# EAGLE design muscle (EAGLE 9.4.2)
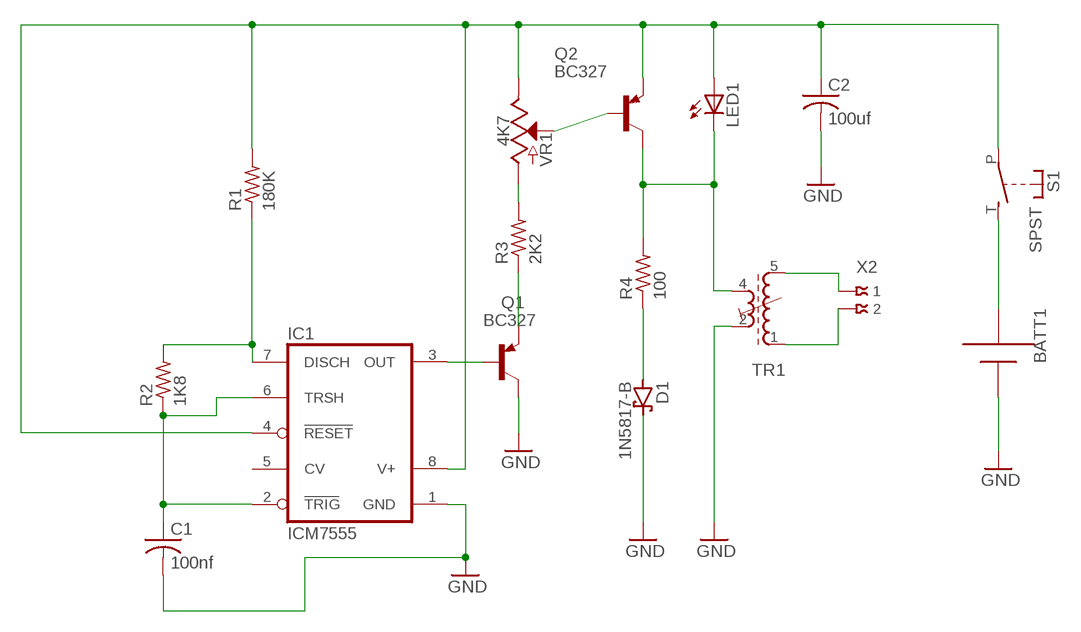
[diagram p0: schematic, sheet 1]

## Parts
BATT1  AAA  [12BH412]
C1  100nf  C-US025-024X044  [C025-024X044]
C2  100uf  C-US025-024X044  [C025-024X044]
D1  1N5817-B  [DO41-7.6]
IC1  ICM7555  [DIL08]
LED1  LED3MM  [LED3MM]
Q1  BC327  [TO92]
Q2  BC327  [TO92]
R1  180K  R-US_0204/2V  [0204V]
R2  1K8  R-US_0204/2V  [0204V]
R3  2K2  R-US_0204/2V  [0204V]
R4  100  R-US_0204/2V  [0204V]
S1  SPST  [JUDCOSPST]
TR1  71-4-1524  [71-5]
VR1  4K7  POTENTIOMETER_SLIDE-20MM-1/10W-20%  [SLIDER-SMALL]
X2  009177002  [009177002]

## Nets
GND: BATT1.+ C1.2 C2.2 D1.C IC1.1(GND) Q1.3(C) TR1.2(A2)
N$1: IC1.3(OUT) Q1.2(B)
N$2: Q1.1(E) R3.1
N$3: R3.2 VR1.BOTTOM(A)
N$4: Q2.2(B) VR1.WIPER(S)
N$5: IC1.7(DISCH) R1.1 R2.2
N$6: C1.1 IC1.2(TRIG) IC1.6(TRSH) R2.1
N$7: C2.1 IC1.4(RESET) IC1.8(V+) LED1.A Q2.1(E) R1.2 S1.P VR1.TOP(E)
N$8: D1.A R4.1
N$9: BATT1.- S1.T(S)
N$10: LED1.K(C) Q2.3(C) R4.2 TR1.4(E2)
N$11: TR1.5(E1) X2.1
N$12: TR1.1(A1) X2.2
Unconnected: IC1.5(CV) TR1.S1 TR1.S2

## Library data of the parts
BATT1 = adafruit:AAA: AAA PC pin holder Mouser part #12BH412 - but pretty much any 1x AAA battery holder should be the same http://www.ladyada.net/library/pcb/eaglelibrary.html; MF: BULGIN; MPN: BX0034; OC_FARNELL: 301061
C1 = adafruit:C-US: CAPACITOR, American symbol; MF: AVX; MPN: 12065C104KAT2A; OC_FARNELL: 499389
C2 = adafruit:C-US: CAPACITOR, American symbol; MF: KEMET; MPN: C1210C107M9PACTU; OC_FARNELL: 1108328
D1 = diode:1N581*: 1.0A SCHOTTKY BARRIER RECTIFIER Source: http://www.diodes.com/datasheets/ds23001.pdf; MF: ON SEMICONDUCTOR; MPN: 1N5817G; OC_FARNELL: 1458990
IC1 = maxim:ICM7555: TIMER; MF: RENESAS; MPN: ICM7555IPAZ; OC_FARNELL: 9663762; OC_NEWARK: 68K4387
LED1 = adafruit:LED: LED OSRAM: - CHIPLED LG R971, LG N971, LY N971, LG Q971, LY Q971, LO R971, LY R971 LH N974, LH R974 LS Q976, LO Q976, LY Q976 LO Q996 - Hyper CHIPLED LW Q18S LB Q993, LB Q99A, LB R99A - SideLED LS A670, LO A670, LY A670, LG A670, LP A670 LB A673, LV A673, LT A673, LW A673 LH A674 LY A675 LS A676, LA A676, LO A676, LY A676, LW A676 LS A679, LY A679, LG A679 - Hyper Micro SIDELED® LS Y876, LA Y876, LO Y876, LY Y876 LT Y87S - SmartLED LW L88C, LW L88S LB L89C, LB L89S, LG L890 LS L89K, LO L89K, LY L89K LS L896, LA L896, LO L896, LY L896 - TOPLED LS T670, LO T670, LY T670, LG T670, LP T670 LSG T670, LSP T670, LSY T670, LOP T670, LYG T670 LG T671, LOG T671, LSG T671 LB T673, LV T673, LT T673, LW T673 LH T674 LS T676, LA T676, LO T676, LY T676, LB T676, LH T676, LSB T676, LW T676 LB T67C, LV T67C, LT T67C, LS T67K, LO T67K, LY T67K, LW E67C LS E67B, LA E67B, LO E67B, LY E67B, LB E67C, LV E67C, LT E67C LW T67C LS T679, LY T679, LG T679 LS T770, LO T770, LY T770, LG T770, LP T770 LB T773, LV T773, LT T773, LW T773 LH T774 LS E675, LA E675, LY E675, LS T675 LS T776, LA T776, LO T776, LY T776, LB T776 LHGB T686 LT T68C, LB T68C - Hyper Mini TOPLED® LB M676 - Mini TOPLED Santana® LG M470 LS M47K, LO M47K, LY M47K Source: http://www.osram.convergy.de/; MF: KINGBRIGHT; MPN: L-424IDT; OC_FARNELL: 1142497
Q1 Q2 = transistor-pnp:BC327: PNP Transistor; OC_FARNELL: unknown
R1-R4 = adafruit:R-US_: RESISTOR, American symbol; OC_FARNELL: unknown
S1 = adafruit:SPST: Judco 50-0015-00; OC_FARNELL: unknown
TR1 = inductor-neosid:71-4-: TRANSFORMER adjustable filter transformer; OC_FARNELL: unknown; OC_NEWARK: unknown
VR1 = SparkFun-Resistors:POTENTIOMETER_SLIDE: Slide Potentiometer Slide-type potentiometers - pots that are adjusted by sliding a wiper up or down. Commonly found en-masse on sound boards. Variants 60MM - Slide Pot - X-Large (10k Linear Taper) <https://www.sparkfun.com/products/9119> (COM-09119) 10k linear slide pot with 60mm travel. Datasheet <http://cdn.sparkfun.com/datasheets/Components/Switches/SC608N-b10k.pdf> 30MM, 30MM-KIT - Slide Pot - Medium (10k Linear Taper) <https://www.sparkfun.com/products/11621> (COM-11621) 10k linear slide pot with 30mm travel. Datasheet <http://cdn.sparkfun.com/datasheets/Components/Switches/C-31-.pdf> (C3031N-1A2-B10K-GP) "KIT" variant, intended for soldering kits, has tStop removed from pads so the component can only be stuffed on one side of the board. 20MM - Slide Pot - Small (10k Linear Taper) <https://www.sparkfun.com/products/11620> (COM-11620) 10k linear slide pot with 20mm travel. Datasheet <http://cdn.sparkfun.com/datasheets/Components/Switches/C-31-.pdf> (C2031N-1A2-B10K-GP); OC_FARNELL: unknown; PROD_ID: RES-11924; SF_SKU: COM-11620; VALUE: 10k
X2 = con-avx:00917?002: Wire to Board Strip IDC Connector 2 WAY Source: http://www.avx.com/docs/Catalogs/9176.pdf http://www.avx.com/docs/Catalogs/9177.pdf; OC_FARNELL: unknown; OC_NEWARK: 09P1124

## Board
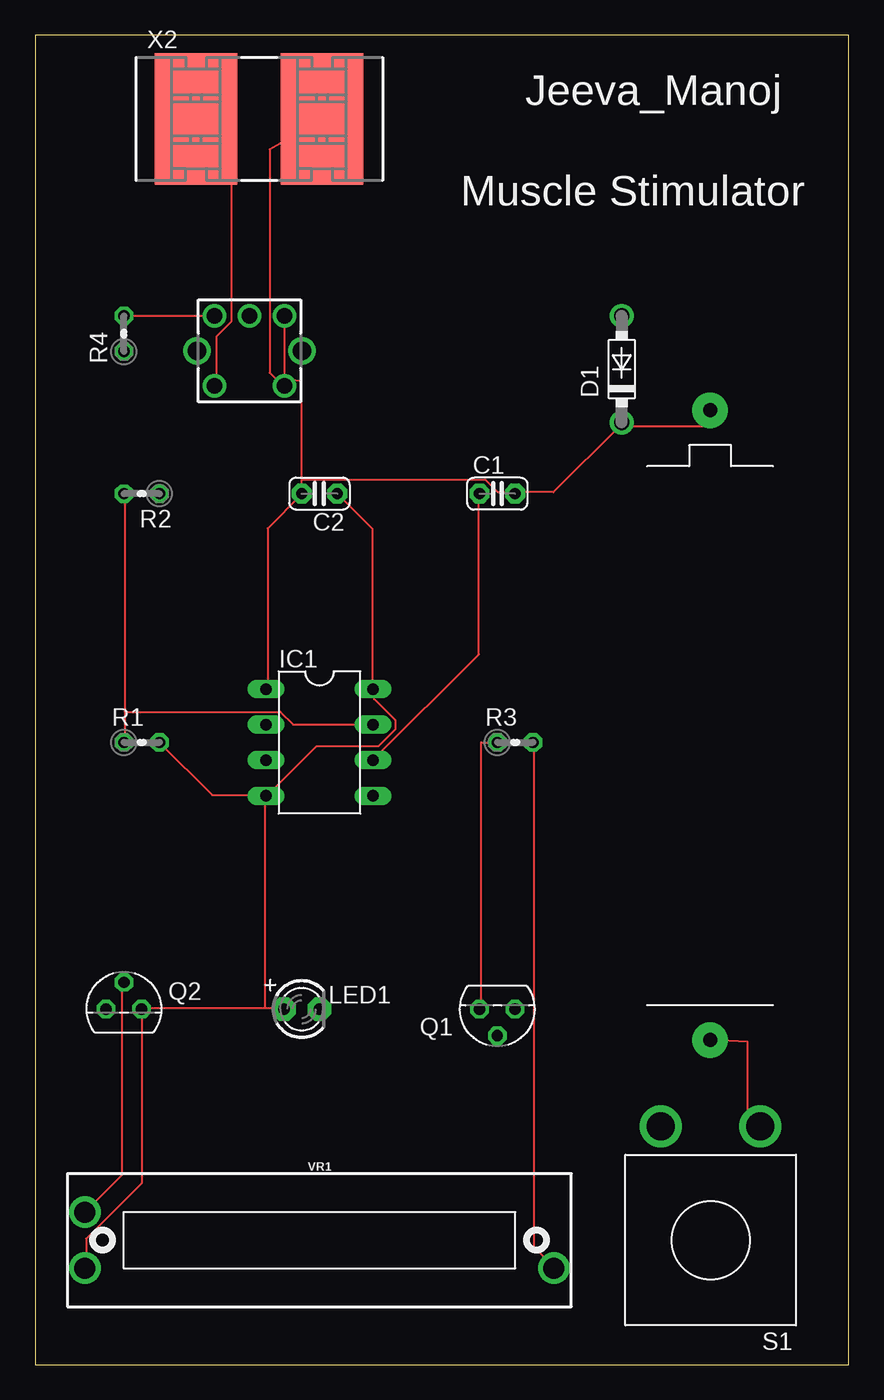
[diagram p1: board, top side]
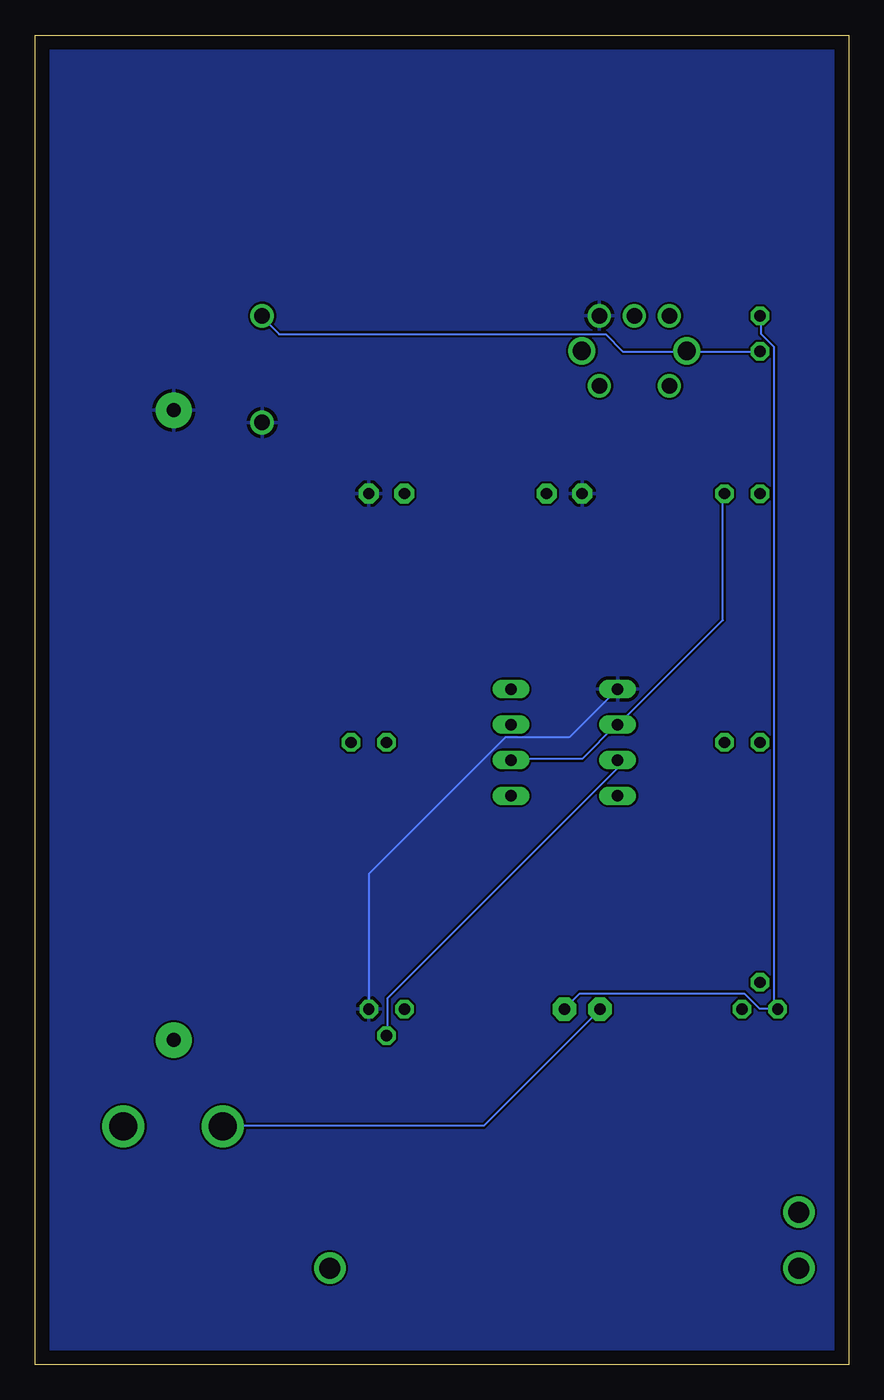
[diagram p2: board, bottom side, seen from below]

Size 58.13 x 95 mm. Coordinates in mm from the lower left corner, seen from the top.
Outline: 0,0 58.13,0 58.13,95 0,95 0,0
Copper layers (1*16): Top 0.035mm / dielectric 1.5mm / Bottom 0.035mm
Design rules "default": minimum track width 6mil, minimum drill 0.35mm, track to track 6mil, track to pad 6mil, pad to pad 6mil, via to via 6mil, smd to smd 6mil, copper to edge 40mil, drill to drill 6mil, minimum pad ring 10mil, minimum via ring 8mil, stop-mask expansion 4mil, vias tented up to drill 0mil, thermal gap 10mil

### Footprints (pad centres in the part's own frame; a part is rotated, then mirrored left to right if it is on the bottom)
12BH412 = drill 1 pad 2.54: + 22.5,0; - -22.5,0
C025-024X044 = drill 0.813 pad 1.422 octagon: 1 -1.27,0; 2 1.27,0
DO41-7.6 = drill 1.1 pad 1.7: A 3.81,0; C -3.81,0
DIL08 = drill 0.813 long: 1 -3.81,-3.81; 2 -1.27,-3.81; 3 1.27,-3.81; 4 3.81,-3.81; 5 3.81,3.81; 6 1.27,3.81; 7 -1.27,3.81; 8 -3.81,3.81
LED3MM = drill 0.813 pad 1.676 octagon: A -1.27,0; K 1.27,0
TO92 = drill 0.813 octagon: 1 1.27,0; 2 0,1.905; 3 -1.27,0
0204V = drill 0.813 octagon: 1 -1.27,0; 2 1.27,0
JUDCOSPST = drill 2: P 3.556,-8.128; T -3.556,-8.128
71-5 = drill 1.1: 1 2.5,-2.5; 2 2.5,2.5; 3 0,2.5; 4 -2.5,2.5; 5 -2.5,-2.5 | drill 1.3: S1 -3.75,0; S2 3.75,0
SLIDER-SMALL = drill 1.5: BOTTOM 16.75,-2; TOP -16.75,-2; WIPER -16.75,2
009177002 = smd 5.9 x 9.4: 1 -4.5,0; 2 4.5,0

### Placement (x,y rotation side)
BATT1  48.22,45.68 90 top
C1  33.02,62.23 0 top
C2  20.32,62.23 180 top
D1  41.91,71.12 90 top
IC1  20.32,44.45 270 top
LED1  19.05,25.4 0 top
Q1  33.02,25.4 180 top
Q2  6.35,25.4 0 top
R1  7.62,44.45 0 top
R2  7.62,62.23 180 top
R3  34.29,44.45 0 top
R4  6.35,73.66 90 top
S1  48.26,8.89 180 top
TR1  15.32,72.43 0 top
VR1  20.32,8.89 0 top
X2  16,89 0 top

### Tracks (layer width: path | path; a pad name or v marks a point on that pad's centre or on a via)
GND
  Top 0.152: 34.29,62.33 37.03,62.33 41.76,67.06 | 41.76,67.06 41.91,67.21 D1.C 41.76,67.06 | 41.76,67.06 47.68,67.06 BATT1.+ | IC1.1 16.61,48.31 16.61,59.74 19.05,62.18 C2.2 19.05,63.25 | 19.05,63.25 19.05,70.26 17.82,70.38 TR1.2 | 34.29,62.33 33.07,62.33 32.16,63.25 19.05,63.25 | 34.29,62.33 C1.2
  Bottom 0.152: Q1.3 34.29,35.05 24.54,44.81 19.96,44.81 IC1.1
  pour Bottom: -2.5,97.5 -2.5,-2.5 60,-2.5 60,97.5
N$1
  Bottom 0.152: IC1.3 16.61,43.13 16.61,42.52 32.92,26.21 32.92,23.62 Q1.2
N$2
  Top 0.152: Q1.1 31.85,25.45 31.85,44.45 R3.1
N$3
  Top 0.152: R3.2 35.66,44.45 35.66,8.38 37.03,7.01 VR1.BOTTOM
N$4
  Top 0.152: Q2.2 6.25,27.28 6.25,13.56 3.66,10.97 VR1.WIPER
N$5
  Top 0.152: 6.4,46.63 6.4,62.18 R2.2 | 6.4,46.63 6.4,44.5 R1.1 | IC1.7 18.44,45.72 17.53,46.63 6.4,46.63
N$6
  Top 0.152: IC1.6 31.7,50.75 31.7,62.18 C1.1
  Bottom 0.152: IC1.6 24.08,43.28 19.05,43.28 16.61,45.72 IC1.2 16.46,45.72 8.99,53.19 8.99,62.18 R2.1
N$7
  Top 0.152: C2.1 24.08,59.74 24.08,48.31 IC1.8 24.23,48.16 24.23,47.55 25.76,46.02 25.76,45.41 24.54,44.2 20.12,44.2 16.61,40.69 IC1.4 | R1.2 12.65,40.69 16.46,40.69 IC1.4 | 16.46,25.45 17.68,25.45 LED1.A | 16.46,25.45 7.62,25.45 Q2.1 7.62,12.95 3.66,8.99 3.66,7.01 VR1.TOP | 16.46,25.45 16.46,40.54 IC1.4
  Bottom 0.152: S1.P 44.65,17.07 26.06,17.07 17.83,25.3 LED1.A
N$8
  Bottom 0.152: R4.1 16.15,72.39 17.37,73.61 40.69,73.61 41.91,74.83 D1.A
N$9
  Top 0.152: BATT1.- 50.9,23.06 50.9,17.98 51.82,17.07 S1.T
N$10
  Top 0.152: R4.2 TR1.4
  Bottom 0.152: 5.33,25.45 6.4,25.45 7.47,26.52 19.2,26.52 LED1.K | 5.33,25.45 5.18,25.45 Q2.3 5.33,25.45 | 5.33,25.45 5.33,72.69 6.25,73.61 6.25,74.83 R4.2
N$11
  Top 0.152: TR1.5 12.95,69.95 12.95,73.46 14.02,74.52 14.02,86.41 11.52,88.92 X2.1
N$12
  Top 0.152: TR1.1 17.68,69.95 16.76,70.87 16.76,86.84 X2.2

### Text on the board
tNames: Jeeva_Manoj | Muscle Stimulator